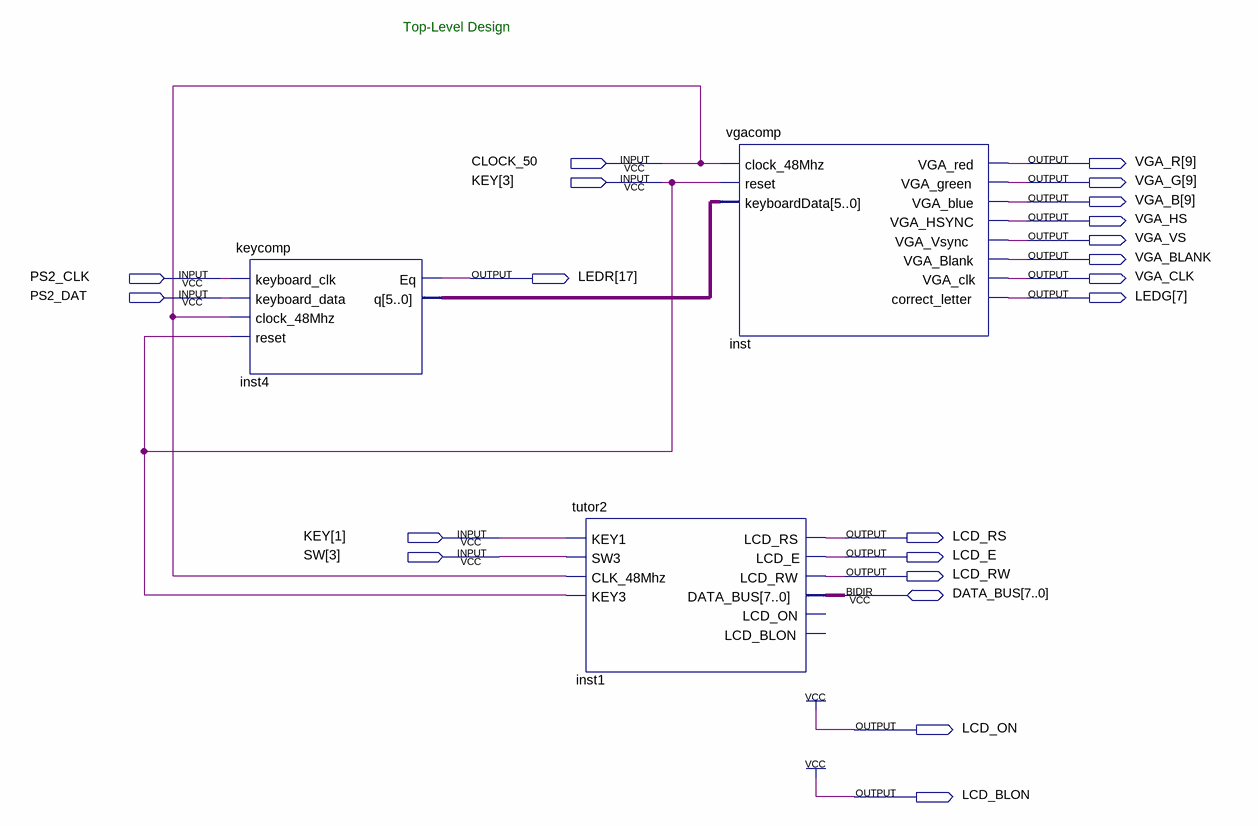
[diagram p0: schematic sheet]
// Quartus schematic FinalProject.bdf as structural Verilog: 3 symbols, 21 pins
module FinalProject (
  input  CLOCK_50,
  input  [3:1] KEY,
  input  PS2_CLK,
  input  PS2_DAT,
  input  [3:3] SW,
  inout  [7:0] DATA_BUS,
  output [9:9] VGA_R,
  output [9:9] VGA_G,
  output [9:9] VGA_B,
  output VGA_HS,
  output VGA_VS,
  output VGA_BLANK,
  output [17:17] LEDR,
  output VGA_CLK,
  output [7:7] LEDG,
  output LCD_RS,
  output LCD_E,
  output LCD_RW,
  output LCD_ON,
  output LCD_BLON
);

  wire [5:0] inst4_q;

  keycomp inst4 (
    .keyboard_clk(PS2_CLK), .keyboard_data(PS2_DAT), .clock_48Mhz(CLOCK_50), .reset(KEY[3]), .Eq(LEDR[17]),
    .q(inst4_q));
  tutor2 inst1 (
    .KEY1(KEY[1]), .SW3(SW[3]), .CLK_48Mhz(CLOCK_50), .KEY3(KEY[3]), .LCD_RS(LCD_RS), .LCD_E(LCD_E),
    .LCD_RW(LCD_RW), .DATA_BUS(DATA_BUS));  // open: LCD_ON, LCD_BLON
  vgacomp inst (
    .clock_48Mhz(CLOCK_50), .reset(KEY[3]), .keyboardData(inst4_q), .VGA_red(VGA_R[9]), .VGA_green(VGA_G[9]),
    .VGA_blue(VGA_B[9]), .VGA_HSYNC(VGA_HS), .VGA_Vsync(VGA_VS), .VGA_Blank(VGA_BLANK), .VGA_clk(VGA_CLK),
    .correct_letter(LEDG[7]));

  assign LCD_BLON = 1'b1;
  assign LCD_ON = 1'b1;

  // Notes on the sheet:
  //   Top-Level Design
endmodule
